# EAGLE design semaforo (EAGLE 7.2.0)
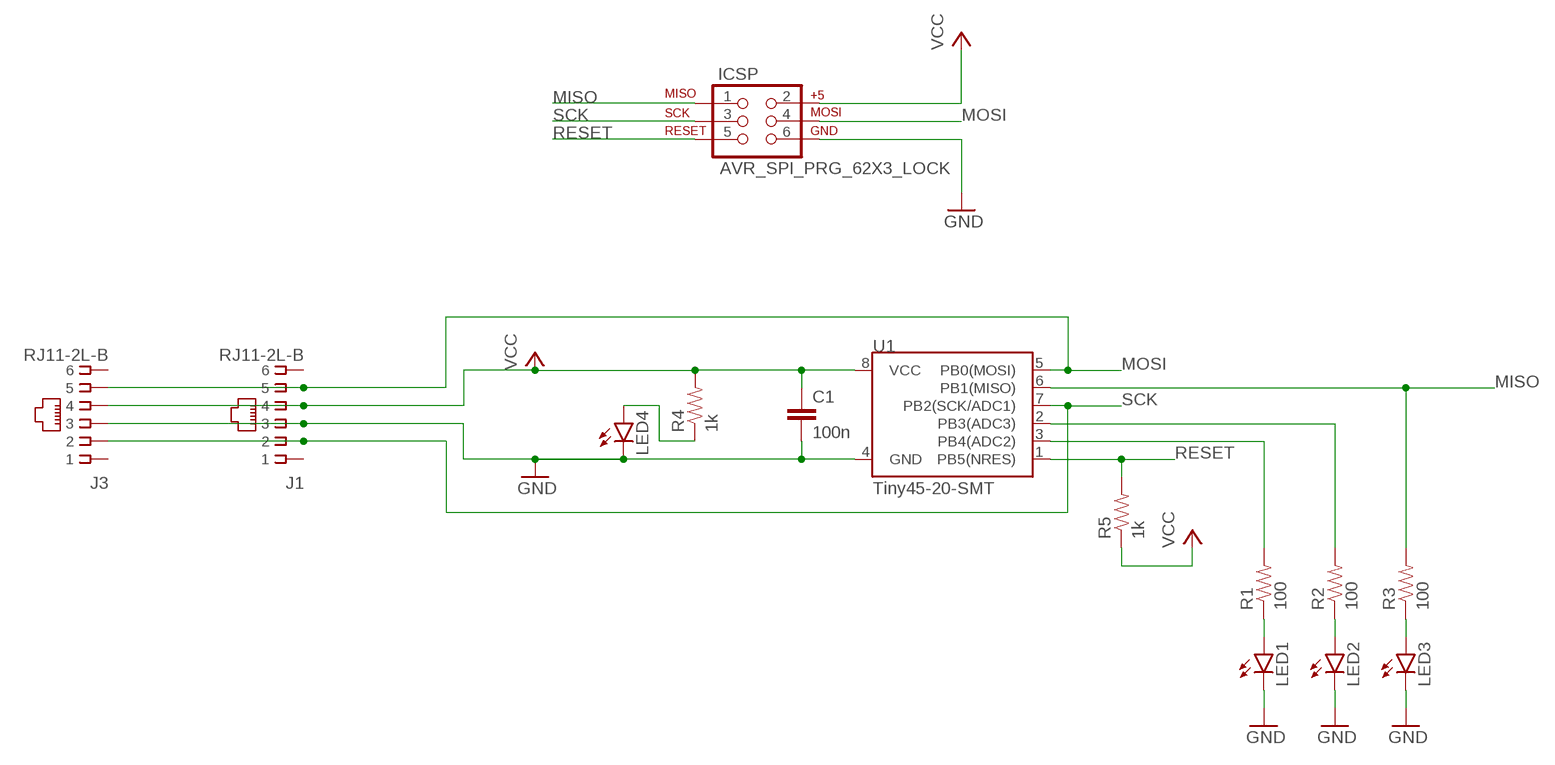
[diagram p0: schematic, sheet 1]

## Parts
C1  100n  CAP1206  [1206]
ICSP  AVR_SPI_PRG_62X3_LOCK  [2X3_LOCK]
J1  RJ11-2L-B  [RJ11-NO_SHIELD]
J3  RJ11-2L-B  [RJ11-NO_SHIELD]
LED1  LED5MM  [LED5MM]
LED2  LED5MM  [LED5MM]
LED3  LED5MM  [LED5MM]
LED4  LED1206  [LED-1206]
R1  100  RESISTOR1206  [1206]
R2  100  RESISTOR1206  [1206]
R3  100  RESISTOR1206  [1206]
R4  1k  RESISTOR1206  [1206]
R5  1k  RESISTOR1206  [1206]
U1  Tiny45-20-SMT  ATTINY45TINY45-20-SMT  [SO08-EIAJ]

## Nets
GND: C1.2 ICSP.6 J1.3 J3.3 LED1.K(C) LED2.K(C) LED3.K(C) LED4.C U1.4(GND)
MISO: ICSP.1 R3.2 U1.6(PB1(MISO))
MOSI: ICSP.4 J1.5 J3.5 U1.5(PB0(MOSI))
N$5: R1.2 U1.3(PB4(ADC2))
N$6: R2.2 U1.2(PB3(ADC3))
N$8: LED4.A R4.1
N$10: LED1.A R1.1
N$12: LED2.A R2.1
N$13: LED3.A R3.1
RESET: ICSP.5 R5.2 U1.1(PB5(NRES))
SCK: ICSP.3 J1.2 J3.2 U1.7(PB2(SCK/ADC1))
VCC: C1.1 ICSP.2 J1.4 J3.4 R4.2 R5.1 U1.8(VCC)
Unconnected: J1.1 J1.6 J3.1 J3.6

## Library data of the parts
C1 = SparkFun-Capacitors:CAP: Capacitor Standard 0603 ceramic capacitor, and 0.1" leaded capacitor.
ICSP = SparkFun-Connectors:AVR_SPI_PRG_6: AVR ISP 6 Pin This is the reduced ISP connector for AVR programming. Common on Arduino. This footprint will take up less PCB space and can be used with a 10-pin to 6-pin adapter such as SKU: BOB-08508 **Special note about "TEST_POINT" package. The stop mask is on the top side, so if you want your programming test points to be on the bottom of your board, make sure to place this package on the bottom side of the board. This also ensure that the orientation to program from the bottom side will be correct.
J1 J3 = con-tycoelectronics:RJ11: CORCOM Modular RJ Jacks No Shield Source: www.tycoelectronics.com .. ENG_DS_1654001_1099_RJ_L_0507.pdf; MF: TYCO ELECTRONICS; MPN: RJ11-2L-B; OC_FARNELL: unknown; OC_NEWARK: 83F4463
LED1-LED4 = SparkFun-LED:LED: LEDs Standard schematic elements and footprints for 5mm, 3mm, 1206, and 0603 sized LEDs. 5mm - Spark Fun Electronics SKU : COM-00529 (and others)
R1-R5 = SparkFun-Passives:RESISTOR: Resistor Basic schematic elements and footprints for 0603, 1206, and PTH resistors.
U1 = SparkFun-DigitalIC:ATTINY45: Atmel 8-pin 2/4/8kB flash uC; PROD_ID: IC-08922

## Board
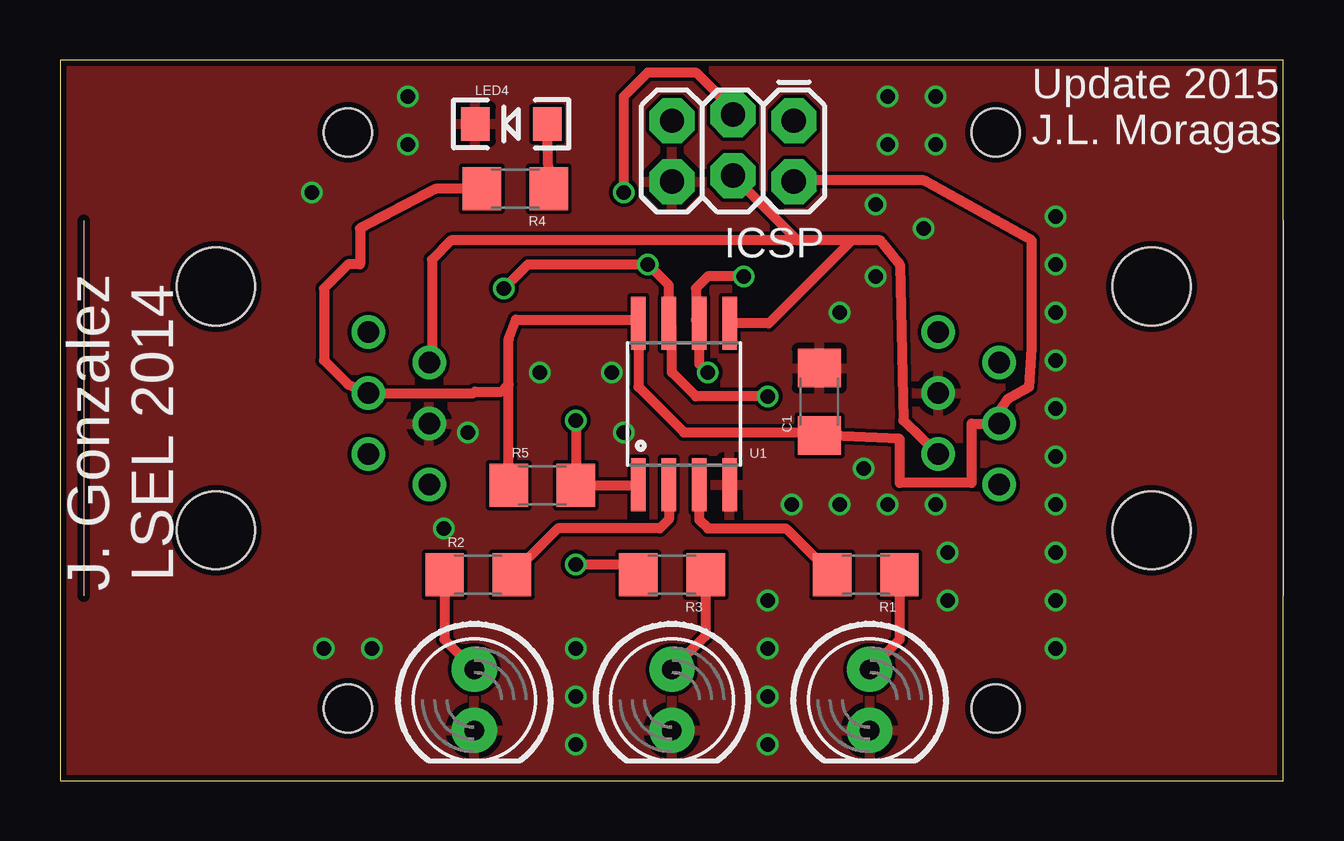
[diagram p1: board, top side]
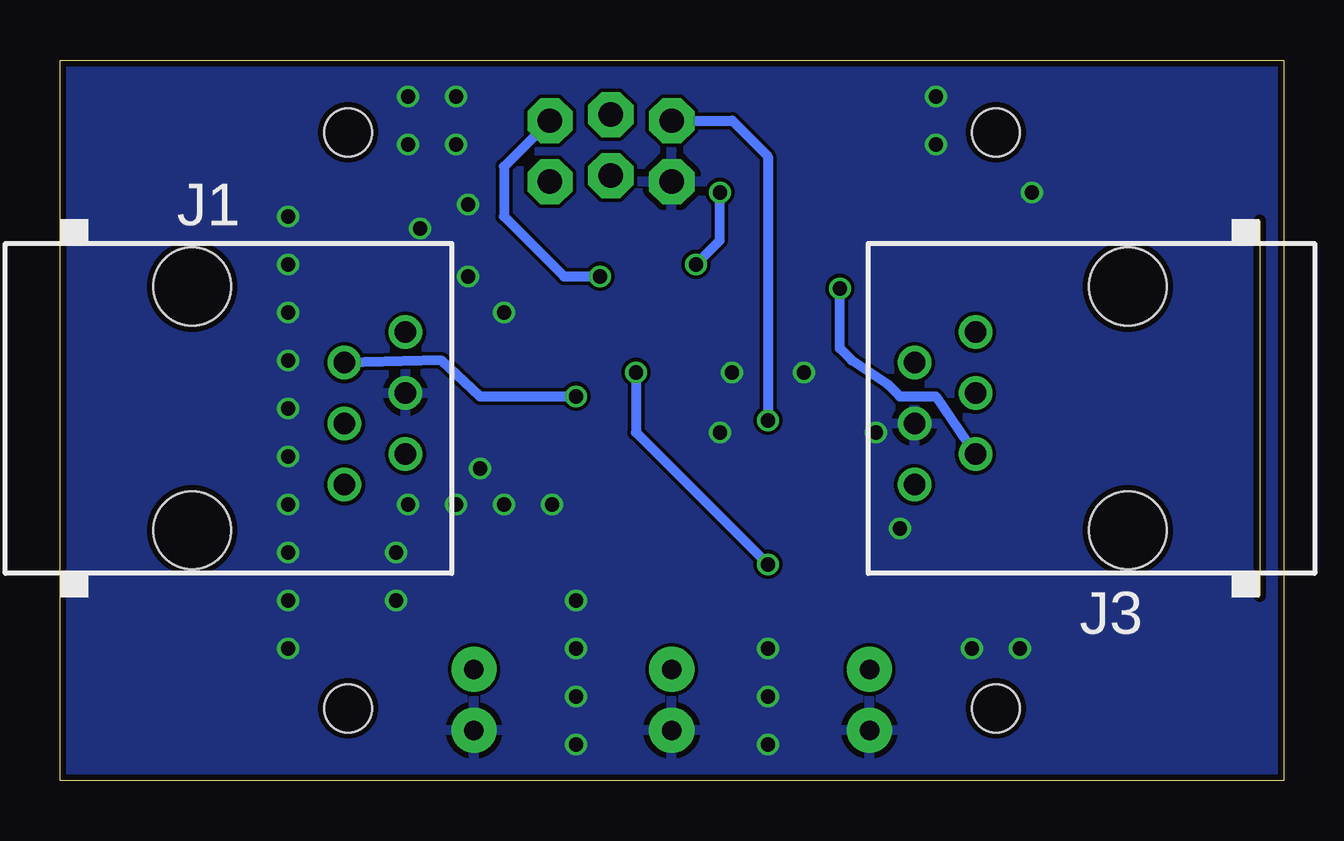
[diagram p2: board, bottom side, seen from below]

Size 51.01 x 30.04 mm. Coordinates in mm from the lower left corner, seen from the top.
Outline: 0,0 50.99,0 50.99,30.04 0,30.04 0,0
Copper layers (1*16): Top 0.035mm / dielectric 0.2mm / Bottom 0.035mm
Design rules "SeeedStudio_DRU_no_angle_20130527 *": minimum track width 6mil, minimum drill 12mil, track to track 6mil, track to pad 6mil, pad to pad 6mil, via to via 6mil, smd to smd 0mil, copper to edge 10mil, drill to drill 10mil, minimum pad ring 6mil, minimum via ring 6mil, stop-mask expansion 2mil, vias tented up to drill 25mil, thermal gap 10mil
Holes 2 mm at 12,27.02 39,27.02 39,3.02 12,3.02

### Footprints (pad centres in the part's own frame; a part is rotated, then mirrored left to right if it is on the bottom)
1206 = smd 1.6 x 1.8: 1 -1.4,0; 2 1.4,0
2X3_LOCK = drill 1.016 pad 1.88 octagon: 1 0,0; 2 0,2.54; 3 2.54,-0.254; 4 2.54,2.286; 5 5.08,0; 6 5.08,2.54
RJ11-NO_SHIELD = drill 0.9 pad 1.4: 1 -3.175,8.89; 2 -1.905,6.35; 3 -0.635,8.89; 4 0.635,6.35; 5 1.905,8.89; 6 3.175,6.35 | hole 3.251: -5.08,0; 5.08,0
LED5MM = drill 0.813 pad 1.88: A -1.27,0; K 1.27,0
LED-1206 = smd 1.2 x 1.4: A -1.5,0; C 1.5,0
SO08-EIAJ = smd 0.61 x 2.21: 1 -1.905,-3.378; 2 -0.635,-3.378; 3 0.635,-3.378; 4 1.905,-3.378; 5 1.905,3.353; 6 0.635,3.353; 7 -0.635,3.353; 8 -1.905,3.353

### Placement (x,y rotation side)
C1  31.65,15.8 90 top
ICSP  30.59,27.51 180 top
J1  45.5,15.52 270 bottom
J3  6.5,15.52 90 bottom
LED1  33.75,3.38 270 top
LED2  17.27,3.38 270 top
LED3  25.51,3.38 270 top
LED4  18.81,27.37 180 top
R1  33.59,8.59 180 top
R2  17.43,8.59 0 top
R3  25.51,8.59 180 top
R4  18.98,24.67 180 top
R5  20.1,12.32 0 top
U1  26.01,15.71 0 top

### Tracks (layer width: path | path; a pad name or v marks a point on that pad's centre or on a via)
GND  (via drill 0.6 pad 0.61)
  other vias: 41.5,5.52 41.5,7.52 41.5,9.52 41.5,11.52 41.5,13.52 41.5,15.52 41.5,17.52 36.5,11.52 37,9.52 37,7.52 41.5,19.52 41.5,21.52 41.5,23.52 34,21.02 32.5,19.52 36,23.02 36.5,26.52 34.5,26.52 14.5,28.52 29.5,5.52 29.5,7.52 34.5,11.52 32.5,11.52 30.5,11.52 33.5,13.02 29.5,3.52 29.5,1.52 21.5,3.52 21.5,5.52 21.5,1.52 13,5.52 16,10.52 20,17.02 23.5,14.52 23,17.02 10.5,24.52 17,14.52 34.5,28.52 36.5,28.52 11,5.52 34,24.02 14.5,26.52
  pour Top: 0,30.02 51,30.02 51,0.02 0,0.02
  pour Bottom: 0,30.02 51,30.02 51,0.02 0,0.02
MISO  (via drill 0.6 pad 0.61)
  Top 0.406: v28.5,21.02 27,21.02 26.5,20.52 26.5,19.21 U1.6 26.65,17.38 v27,17.02 | v21.5,9.02 23.68,9.02 R3.2
  Bottom 0.406: ICSP.1 32.5,25.6 32.5,23.52 30,21.02 v28.5,21.02 | v27,17.02 27,14.52 v21.5,9.02
MOSI
  Top 0.406: 30.75,22.52 16.3,22.52 15.5,21.72 15.5,17.54 J3.5 | 33,22.52 34.2,22.52 35,21.52 35.15,15.02 J1.5 | 33,22.52 30.75,22.52 | 30.75,22.52 ICSP.4 | 33,22.52 29.54,19.06 U1.5
N$5
  Top 0.406: U1.3 26.65,10.88 27,10.52 30.26,10.52 R1.2
N$6
  Top 0.406: U1.2 25.38,10.9 25,10.52 20.76,10.52 R2.2
N$8
  Top 0.406: R4.1 LED4.A
N$10
  Top 0.406: R1.1 34.99,5.89 LED1.A
N$12
  Top 0.406: R2.1 16.03,5.89 LED2.A
N$13
  Top 0.406: R3.1 26.91,6.05 LED3.A
RESET  (via drill 0.6 pad 0.61)
  Top 0.406: U1.1 R5.2 v21.5,15.02
  Bottom 0.406: ICSP.5 22.98,27.51 21.5,26.02 v21.5,15.02
SCK  (via drill 0.6 pad 0.61)
  Top 0.406: v23.5,24.52 23.5,28.52 24.5,29.52 26.5,29.52 28.05,27.97 ICSP.3 | v18.5,20.52 19.5,21.52 v24.5,21.52 25.38,20.65 U1.7 25.5,18.94 25.5,17.02 26.5,16.02 v29.5,16.02
  Bottom 0.406: v24.5,21.52 23.5,22.52 v23.5,24.52 | v18.5,20.52 18.5,18.02 18,17.52 16.5,16.52 16,16.02 14.5,16.02 J3.2 | v29.5,16.02 33.5,16.02 35.11,17.52 J1.2
VCC
  Top 0.406: ICSP.2 30.65,25.02 36,25.02 40.5,22.52 40.5,18.02 40.4,16.42 39.5,15.92 39.15,15.42 J1.4 38,14.89 38,12.42 35,12.42 35,14.25 C1.1 31.52,14.52 26,14.52 24.11,16.42 U1.8 23.95,19.22 19,19.22 18.7,18.42 18.7,16.52 | R4.2 15.65,24.67 12.5,23.02 12.5,21.52 12,21.52 11,20.52 11,17.52 12,16.52 J3.4 17.23,16.16 17.3,16.22 18.4,16.22 18.7,16.52 | R5.1 18.7,16.52

### Text on the board
tPlace: Update 2015 / J.L. Moragas | J. Gonzalez / LSEL 2014